# Altium schematic sheet LwIP.SchDoc
size A4
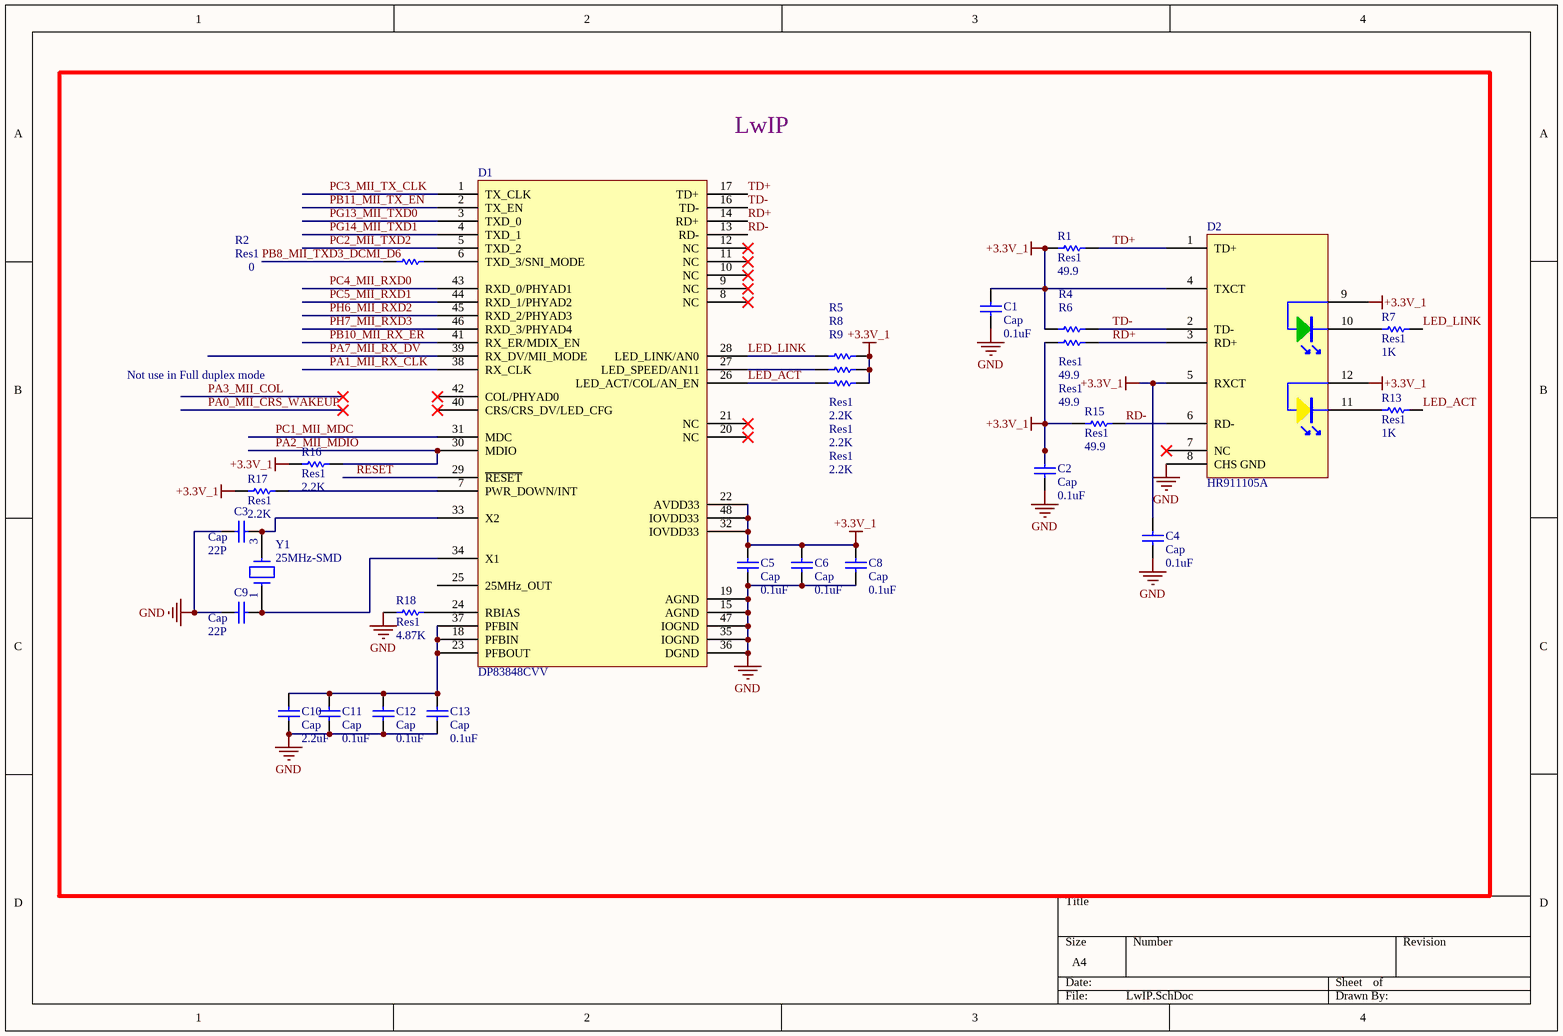
[diagram p0: LwIP.SchDoc]

## Parts
C1  Cap  value 0.1uF  [0805_C]
C2  Cap  value 0.1uF  [0805_C]
C3  Cap  value 22P  [0805_C]
C4  Cap  value 0.1uF  [0805_C]
C5  Cap  value 0.1uF  [0805_C]
C6  Cap  value 0.1uF  [0805_C]
C8  Cap  value 0.1uF  [0805_C]
C9  Cap  value 22P  [0805_C]
C10  Cap  value 2.2uF  [0805_C]
C11  Cap  value 0.1uF  [0805_C]
C12  Cap  value 0.1uF  [0805_C]
C13  Cap  value 0.1uF  [0805_C]
D1  DP83848CVV  [LQFP48]
D2  HR911105A  [RJ45-LED]
R1  Res1  value 49.9  [0805_C]
R2  Res1  value 0  [0805_C]
R4  Res1  value 49.9  [0805_C]
R5  Res1  value 2.2K  [0805_C]
R6  Res1  value 49.9  [0805_C]
R7  Res1  value 1K  [0805_C]
R8  Res1  value 2.2K  [0805_C]
R9  Res1  value 2.2K  [0805_C]
R13  Res1  value 1K  [0805_C]
R15  Res1  value 49.9  [0805_C]
R16  Res1  value 2.2K  [0805_C]
R17  Res1  value 2.2K  [0805_C]
R18  Res1  value 4.87K  [0805_C]
Y1  25MHz-SMD  [XTAL-3225]

## Nets
+3.3V_1: C1.1 C2.1 C4.1 C5.1 C6.1 C8.1 D1.22(AVDD33) D1.32(IOVDD33) D1.48(IOVDD33) D2.4(TXCT) D2.5(RXCT) D2.9 D2.12 R1.1 R4.1 R5.2 R6.1 R8.2 R9.2 R15.1 R16.2 R17.2
GND: C1.2 C2.2 C3.1 C4.2 C5.2 C6.2 C8.2 C9.1 C10.2 C11.2 C12.2 C13.2 D1.15(AGND) D1.19(AGND) D1.35(IOGND) D1.36(DGND) D1.47(IOGND) D2.8(CHS_GND) R18.2
LED_ACT: D1.26(LED_ACT/COL/AN_EN) R9.1 R13.2
LED_LINK: D1.28(LED_LINK/AN0) R5.1 R7.2
PA1_MII_RX_CLK: D1.38(RX_CLK)
PA2_MII_MDIO: D1.30(MDIO) R16.1
PA7_MII_RX_DV: D1.39(RX_DV/MII_MODE)
PB8_MII_TXD3_DCMI_D6: R2.1
PB10_MII_RX_ER: D1.41(RX_ER/MDIX_EN)
PB11_MII_TX_EN: D1.2(TX_EN)
PC1_MII_MDC: D1.31(MDC)
PC2_MII_TXD2: D1.5(TXD_2)
PC3_MII_TX_CLK: D1.1(TX_CLK)
PC4_MII_RXD0: D1.43(RXD_0/PHYAD1)
PC5_MII_RXD1: D1.44(RXD_1/PHYAD2)
PG13_MII_TXD0: D1.3(TXD_0)
PG14_MII_TXD1: D1.4(TXD_1)
PH6_MII_RXD2: D1.45(RXD_2/PHYAD3)
PH7_MII_RXD3: D1.46(RXD_3/PHYAD4)
RD+: D1.14(RD+) D2.3(RD+) R6.2
RD-: D1.13(RD-) D2.6(RD-) R15.2
RESET: D1.29(~{RESET})
TD+: D1.17(TD+) D2.1(TD+) R1.2
TD-: D1.16(TD-) D2.2(TD-) R4.2
NetC3_2: C3.2 D1.33(X2) Y1.3
NetC9_2: C9.2 D1.34(X1) Y1.1
NetC10_1: C10.1 C11.1 C12.1 C13.1 D1.18(PFBIN) D1.23(PFBOUT) D1.37(PFBIN)
NetD1_6: D1.6(TXD_3/SNI_MODE) R2.2
NetD1_7: D1.7(PWR_DOWN/INT) R17.1
NetD1_24: D1.24(RBIAS) R18.1
NetD1_27: D1.27(LED_SPEED/AN11) R8.1
NetD2_10: D2.10 R7.1
NetD2_11: D2.11 R13.1

Not connected (* = marked no-connect by the designer): D1 8(NC)* 9(NC)* 10(NC)* 11(NC)* 12(NC)* 20(NC)* 21(NC)* 25(25MHz_OUT) 40(CRS/CRS_DV/LED_CFG)* 42(COL/PHYAD0)*; D2 7(NC)*

## Notes on the sheet
- LwIP
- Not use in Full duplex mode

## Library data of the parts
C1-C6 C8-C13 = Cap: Capacitor; Published: 8-Jun-2000; LatestRevisionDate: 17-Jul-2002; LatestRevisionNote: Re-released for DXP Platform.; PackageReference: RAD-0.3; Publisher: Altium Limited; PackageDescription: Radial Cap, Thru-Hole; 2 Leads; 0.3 in Pin Spacing
R1 R2 R4-R9 R13 R15-R18 = Res1: Resistor; Published: 8-Jun-2000; LatestRevisionDate: 17-Jul-2002; LatestRevisionNote: Re-released for DXP Platform.; PackageReference: AXIAL-0.3; Publisher: Altium Limited; PackageDescription: Axial Device, Thru-Hole; 2 Leads; 0.3 in Pin Spacing
Y1 = CRYSTAL-SMD: Crystal